# Altium schematic sheet I2C_CH3.SchDoc
size A3; ApprovedBy: D. Grossman; CheckedBy: G. Engel; Author: Y. Yakov; CompanyName: LightSense; DrawnBy: Y. Yakov; Engineer: Y.Yakov; Organization: LightSense
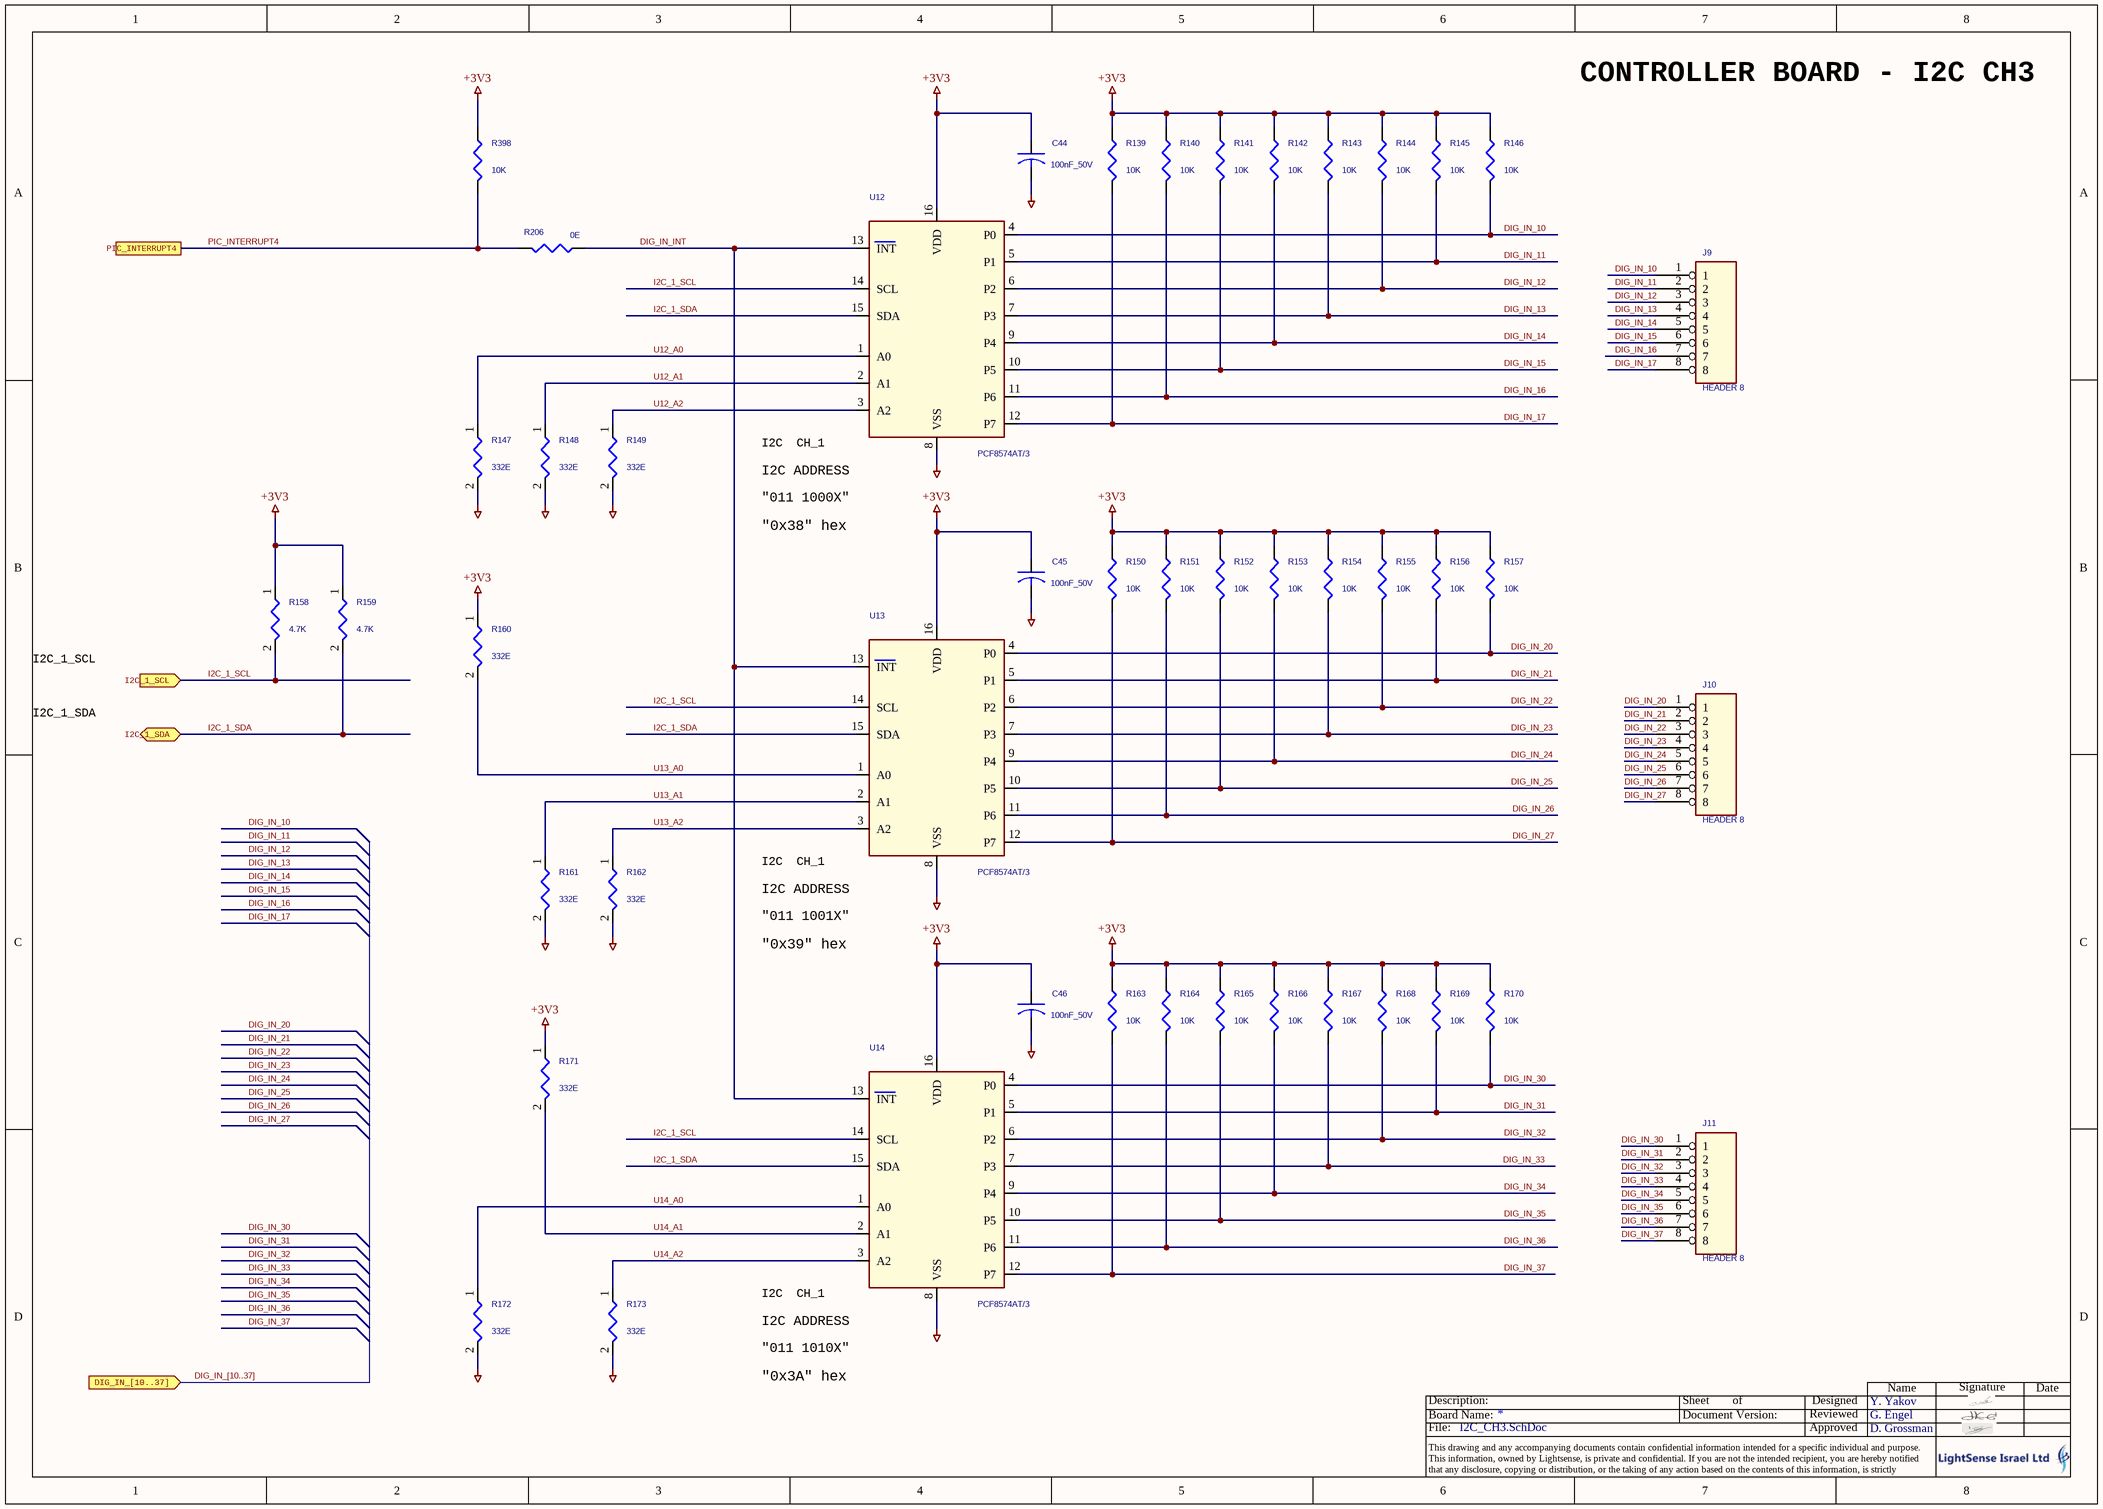
[diagram p0: I2C_CH3.SchDoc]

## Parts
C44  100nF_50V  [0603]
C45  100nF_50V  [0603]
C46  100nF_50V  [0603]
J9  HEADER 8  [TH_8PIN_100mil]
J10  HEADER 8  [TH_8PIN_100mil]
J11  HEADER 8  [TH_8PIN_100mil]
R139  10K  [0603]
R140  10K  [0603]
R141  10K  [0603]
R142  10K  [0603]
R143  10K  [0603]
R144  10K  [0603]
R145  10K  [0603]
R146  10K  [0603]
R147  332E  [R0603]
R148  332E  [R0603]
R149  332E  [R0603]
R150  10K  [0603]
R151  10K  [0603]
R152  10K  [0603]
R153  10K  [0603]
R154  10K  [0603]
R155  10K  [0603]
R156  10K  [0603]
R157  10K  [0603]
R158  4.7K  [R0603]
R159  4.7K  [R0603]
R160  332E  [R0603]
R161  332E  [R0603]
R162  332E  [R0603]
R163  10K  [0603]
R164  10K  [0603]
R165  10K  [0603]
R166  10K  [0603]
R167  10K  [0603]
R168  10K  [0603]
R169  10K  [0603]
R170  10K  [0603]
R171  332E  [R0603]
R172  332E  [R0603]
R173  332E  [R0603]
R206  0E  [0805R]
R398  10K  [0603]
U12  PCF8574AT/3  [SO_16]
U13  PCF8574AT/3  [SO_16]
U14  PCF8574AT/3  [SO_16]

## Ports
DIG_IN_[10..37] (in), I2C_1_SCL (in), I2C_1_SDA (bidir), PIC_INTERRUPT4

## Nets
+3V3: C44.1 C45.1 C46.1 R139.1 R140.1 R141.1 R142.1 R143.1 R144.1 R145.1 R146.1 R150.1 R151.1 R152.1 R153.1 R154.1 R155.1 R156.1 R157.1 R158.1 R159.1 R160.1 R163.1 R164.1 R165.1 R166.1 R167.1 R168.1 R169.1 R170.1 R171.1 R398.1 U12.16(VDD) U13.16(VDD) U14.16(VDD)
GND_CPU: C44.2 C45.2 C46.2 R147.2 R148.2 R149.2 R161.2 R162.2 R172.2 R173.2 U12.8(VSS) U13.8(VSS) U14.8(VSS)
DIG_IN_10: J9.1 R146.2 U12.4(P0)
DIG_IN_11: J9.2 R145.2 U12.5(P1)
DIG_IN_12: J9.3 R144.2 U12.6(P2)
DIG_IN_13: J9.4 R143.2 U12.7(P3)
DIG_IN_14: J9.5 R142.2 U12.9(P4)
DIG_IN_15: J9.6 R141.2 U12.10(P5)
DIG_IN_16: J9.7 R140.2 U12.11(P6)
DIG_IN_17: J9.8 R139.2 U12.12(P7)
DIG_IN_20: J10.1 R157.2 U13.4(P0)
DIG_IN_21: J10.2 R156.2 U13.5(P1)
DIG_IN_22: J10.3 R155.2 U13.6(P2)
DIG_IN_23: J10.4 R154.2 U13.7(P3)
DIG_IN_24: J10.5 R153.2 U13.9(P4)
DIG_IN_25: J10.6 R152.2 U13.10(P5)
DIG_IN_26: J10.7 R151.2 U13.11(P6)
DIG_IN_27: J10.8 R150.2 U13.12(P7)
DIG_IN_30: J11.1 R170.2 U14.4(P0)
DIG_IN_31: J11.2 R169.2 U14.5(P1)
DIG_IN_32: J11.3 R168.2 U14.6(P2)
DIG_IN_33: J11.4 R167.2 U14.7(P3)
DIG_IN_34: J11.5 R166.2 U14.9(P4)
DIG_IN_35: J11.6 R165.2 U14.10(P5)
DIG_IN_36: J11.7 R164.2 U14.11(P6)
DIG_IN_37: J11.8 R163.2 U14.12(P7)
DIG_IN_INT: R206.1 U12.13(INT) U13.13(INT) U14.13(INT)
I2C_1_SCL: R158.2 U12.14(SCL) U13.14(SCL) U14.14(SCL) ; port I2C_1_SCL
I2C_1_SDA: R159.2 U12.15(SDA) U13.15(SDA) U14.15(SDA) ; port I2C_1_SDA
PIC_INTERRUPT4: R206.2 R398.2 ; port PIC_INTERRUPT4
U12_A0: R147.1 U12.1(A0)
U12_A1: R148.1 U12.2(A1)
U12_A2: R149.1 U12.3(A2)
U13_A0: R160.2 U13.1(A0)
U13_A1: R161.1 U13.2(A1)
U13_A2: R162.1 U13.3(A2)
U14_A0: R172.1 U14.1(A0)
U14_A1: R171.2 U14.2(A1)
U14_A2: R173.1 U14.3(A2)

## Buses and harness runs
bus DIG_IN_[10..37] = port DIG_IN_[10..37]

## Notes on the sheet
- CONTROLLER BOARD - I2C CH3
- (near U12) I2C  CH_1
- (near U12) I2C ADDRESS
- "011 1000X"
- "0x38" hex
- I2C_1_SDA
- I2C_1_SCL
- (near U13) I2C  CH_1
- (near U13) I2C ADDRESS
- "011 1001X"
- "0x39" hex
- (near U14) I2C  CH_1
- (near U14) I2C ADDRESS
- "0x3A" hex
- "011 1010X"
- Name
- Signature
- Date
- File:
- Board Name:
- Description:
- Document Version:
- Sheet
- of
- Approved
- Reviewed
- Designed
- This drawing and any accompanying documents contain confidential information intended for a specific individual and purpose.
  This information, owned by Lightsense, is private and confidential. If you are not the intended recipient, you are hereby notified that any disclosure, copying or distribution, or the taking of any action based on the contents of this information, is strictly prohibited.

## Library data of the parts
C44-C46 = C: CAP_SMT_0603_50V_X7R_10%; MFG: KEMET; MFG_PN: C0603C104K5RAC
R139-R146 R150-R157 R163-R170 = R_Dup1: MFG: YAGEO; MFG_PN: RC0603FR-0710K0L
R147-R149 R161 = R: MFG: YAGEO; MFG_PN: RC0603FR-07332RL
R158-R160 R162 R171-R173 = R: MFG_PN: RC0603FR-07332RL; MFG: YAGEO
R206 = R_Dup1: MFG: YAGEO; MFG_PN: RC0603FR-0710R0L
R398 = R_Dup1: MFG_PN: RC0603FR-0710K0L; MFG: YAGEO
U12 U13 = PCF8574_0: PORT I2C, 8Bit, SO_16; MFG: NXP; MFG_PN: PCF8574AT/3
U14 = PCF8574_0: PORT I2C, 8Bit, SO16; MFG: NXP; MFG_PN: PCF8574AT/3